# EAGLE design IOIO Homemade (EAGLE 5.11)
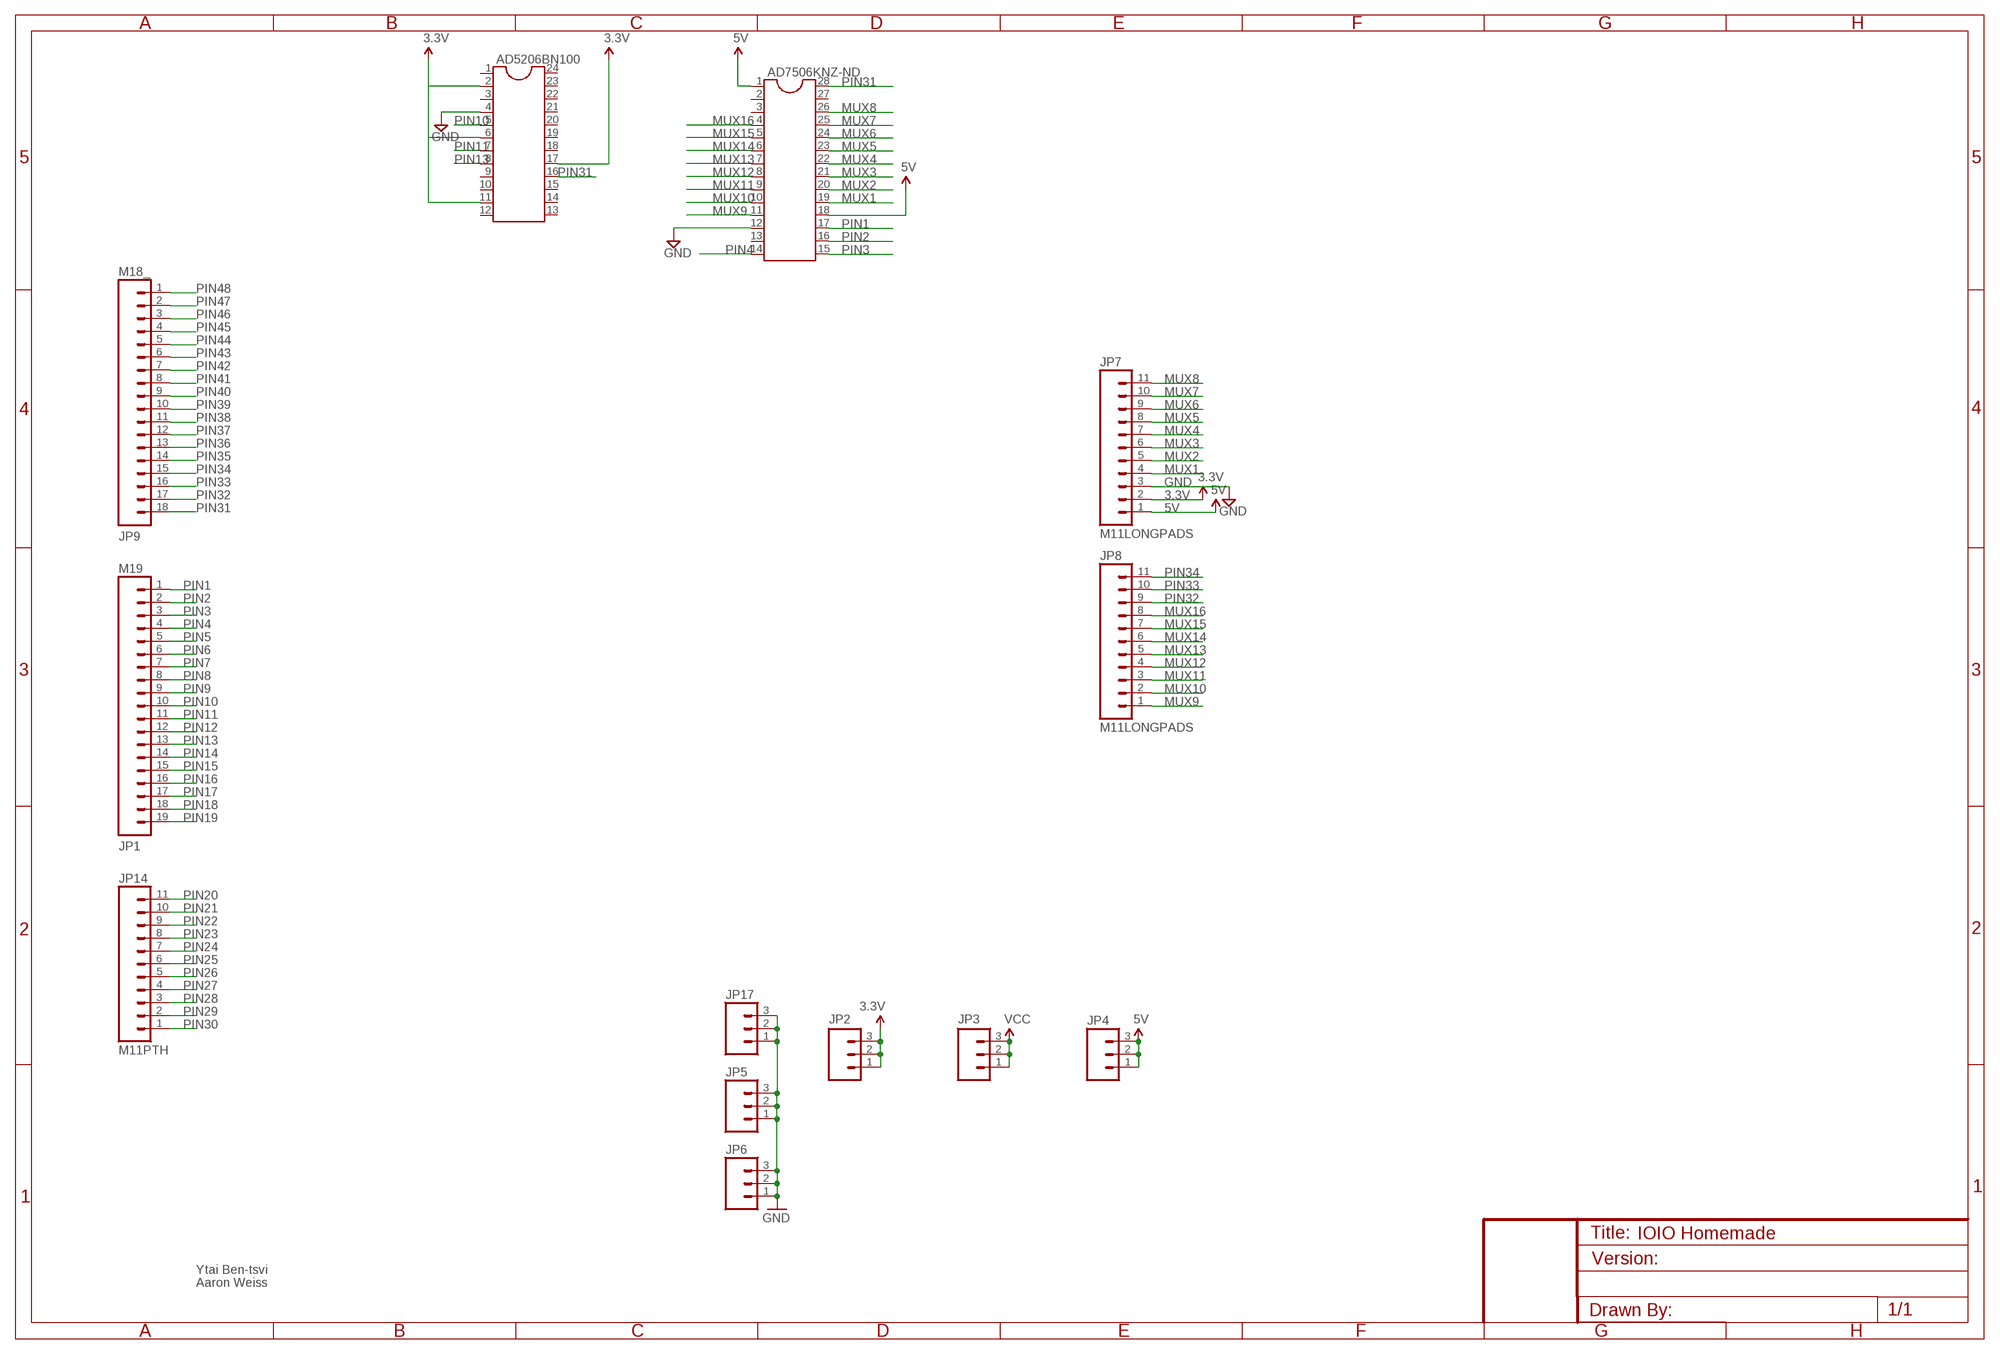
[diagram p0: schematic, sheet 1]

## Parts
AD5206BN100  DIL24-3  [DIL24-3]
AD7506KNZ-ND  DIL28  [DIL28-6]
JP1  M19  [1X19]
JP2  M03PTH  [1X03]
JP3  M03PTH  [1X03]
JP4  M03PTH  [1X03]
JP5  M03PTH  [1X03]
JP6  M03PTH  [1X03]
JP7  M11LONGPADS  [1X11_LONGPADS]
JP8  M11LONGPADS  [1X11_LONGPADS]
JP9  M18_  [1X18]
JP14  M11PTH  [1X11]
JP17  M03PTH  [1X03]

## Nets
3.3V: AD5206BN100.2 AD5206BN100.6 AD5206BN100.11 AD5206BN100.17 JP2.1 JP2.2 JP2.3 JP7.2
5V: AD7506KNZ-ND.1 AD7506KNZ-ND.18 JP4.1 JP4.2 JP4.3 JP7.1
GND: AD5206BN100.4 AD7506KNZ-ND.12 JP5.1 JP5.2 JP5.3 JP6.1 JP6.2 JP6.3 JP7.3 JP17.1 JP17.2 JP17.3
MUX1: AD7506KNZ-ND.19 JP7.4
MUX2: AD7506KNZ-ND.20 JP7.5
MUX3: AD7506KNZ-ND.21 JP7.6
MUX4: AD7506KNZ-ND.22 JP7.7
MUX5: AD7506KNZ-ND.23 JP7.8
MUX6: AD7506KNZ-ND.24 JP7.9
MUX7: AD7506KNZ-ND.25 JP7.10
MUX8: AD7506KNZ-ND.26 JP7.11
MUX9: AD7506KNZ-ND.11 JP8.1
MUX10: AD7506KNZ-ND.10 JP8.2
MUX11: AD7506KNZ-ND.9 JP8.3
MUX12: AD7506KNZ-ND.8 JP8.4
MUX13: AD7506KNZ-ND.7 JP8.5
MUX14: AD7506KNZ-ND.6 JP8.6
MUX15: AD7506KNZ-ND.5 JP8.7
MUX16: AD7506KNZ-ND.4 JP8.8
PIN1: AD7506KNZ-ND.17 JP1.1
PIN2: AD7506KNZ-ND.16 JP1.2
PIN3: AD7506KNZ-ND.15 JP1.3
PIN4: AD7506KNZ-ND.14 JP1.4
PIN5: JP1.5
PIN6: JP1.6
PIN7: JP1.7
PIN8: JP1.8
PIN9: JP1.9
PIN10: AD5206BN100.5 JP1.10
PIN11: AD5206BN100.7 JP1.11
PIN12: JP1.12
PIN13: AD5206BN100.8 JP1.13
PIN14: JP1.14
PIN15: JP1.15
PIN16: JP1.16
PIN17: JP1.17
PIN18: JP1.18
PIN19: JP1.19
PIN20: JP14.11
PIN21: JP14.10
PIN22: JP14.9
PIN23: JP14.8
PIN24: JP14.7
PIN25: JP14.6
PIN26: JP14.5
PIN27: JP14.4
PIN28: JP14.3
PIN29: JP14.2
PIN30: JP14.1
PIN31: AD5206BN100.16 AD7506KNZ-ND.28 JP9.18
PIN32: JP8.9 JP9.17
PIN33: JP8.10 JP9.16
PIN34: JP8.11 JP9.15
PIN35: JP9.14
PIN36: JP9.13
PIN37: JP9.12
PIN38: JP9.11
PIN39: JP9.10
PIN40: JP9.9
PIN41: JP9.8
PIN42: JP9.7
PIN43: JP9.6
PIN44: JP9.5
PIN45: JP9.4
PIN46: JP9.3
PIN47: JP9.2
PIN48: JP9.1
VCC: JP3.1 JP3.2 JP3.3
Unconnected: AD5206BN100.1 AD5206BN100.3 AD5206BN100.9 AD5206BN100.10 AD5206BN100.12 AD5206BN100.13 AD5206BN100.14 AD5206BN100.15 AD5206BN100.18 AD5206BN100.19 AD5206BN100.20 AD5206BN100.21 AD5206BN100.22 AD5206BN100.23 AD5206BN100.24 AD7506KNZ-ND.2 AD7506KNZ-ND.3 AD7506KNZ-ND.13 AD7506KNZ-ND.27

## Notes on the sheet
- Ytai Ben-tsvi
- Aaron Weiss

## Library data of the parts
AD5206BN100 = ic-package:DIL24: Dual In Line
AD7506KNZ-ND = ic-package:DIL28: Dual In Line
JP1 = SparkFun:M19
JP2-JP6 JP17 = SparkFun:M03: Header 3 Standard 3-pin 0.1" header. Use with straight break away headers (SKU : PRT-00116), right angle break away headers (PRT-00553), swiss pins (PRT-00743), machine pins (PRT-00117), and female headers (PRT-00115). Molex polarized connector foot print use with SKU : PRT-08232 with associated crimp pins and housings.
JP7 JP8 JP14 = SparkFun:M11: Header 11 Standard 11-pin 0.1" header. Use with straight break away headers (SKU : PRT-00116), right angle break away headers (PRT-00553), swiss pins (PRT-00743), machine pins (PRT-00117), and female headers (PRT-00115).
JP9 = SparkFun:M18

## Board
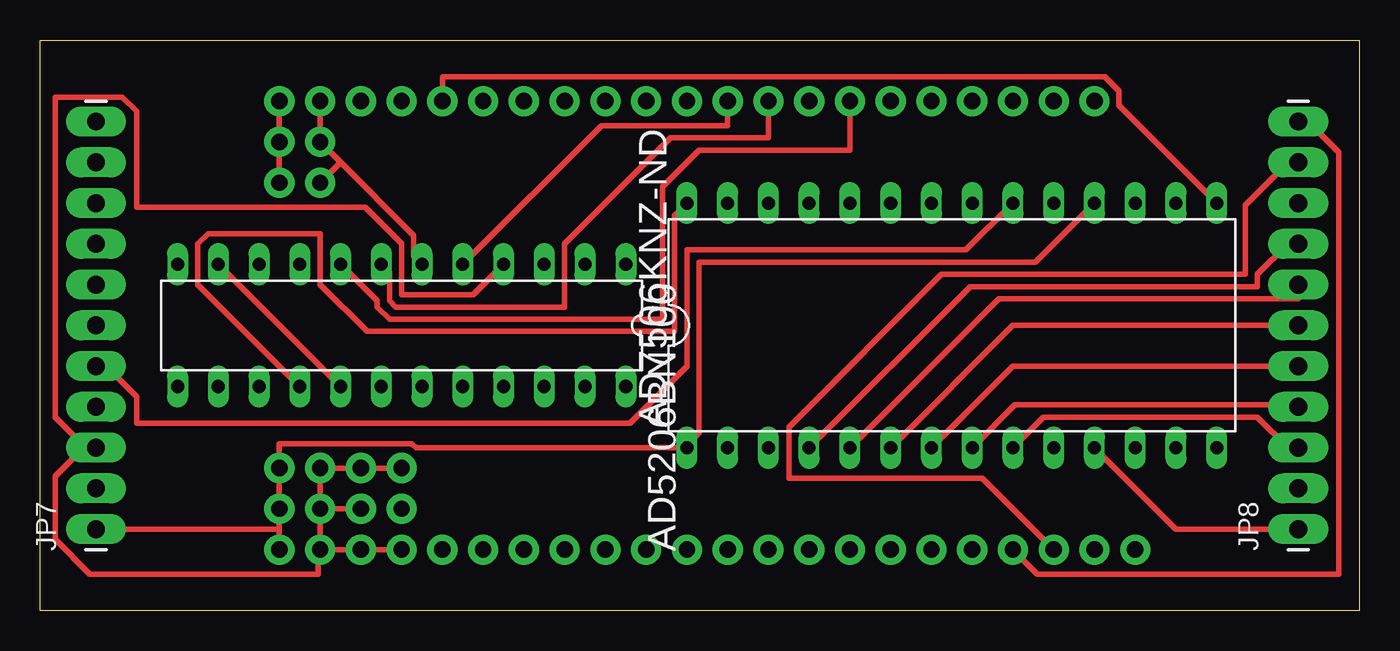
[diagram p1: board, top side]
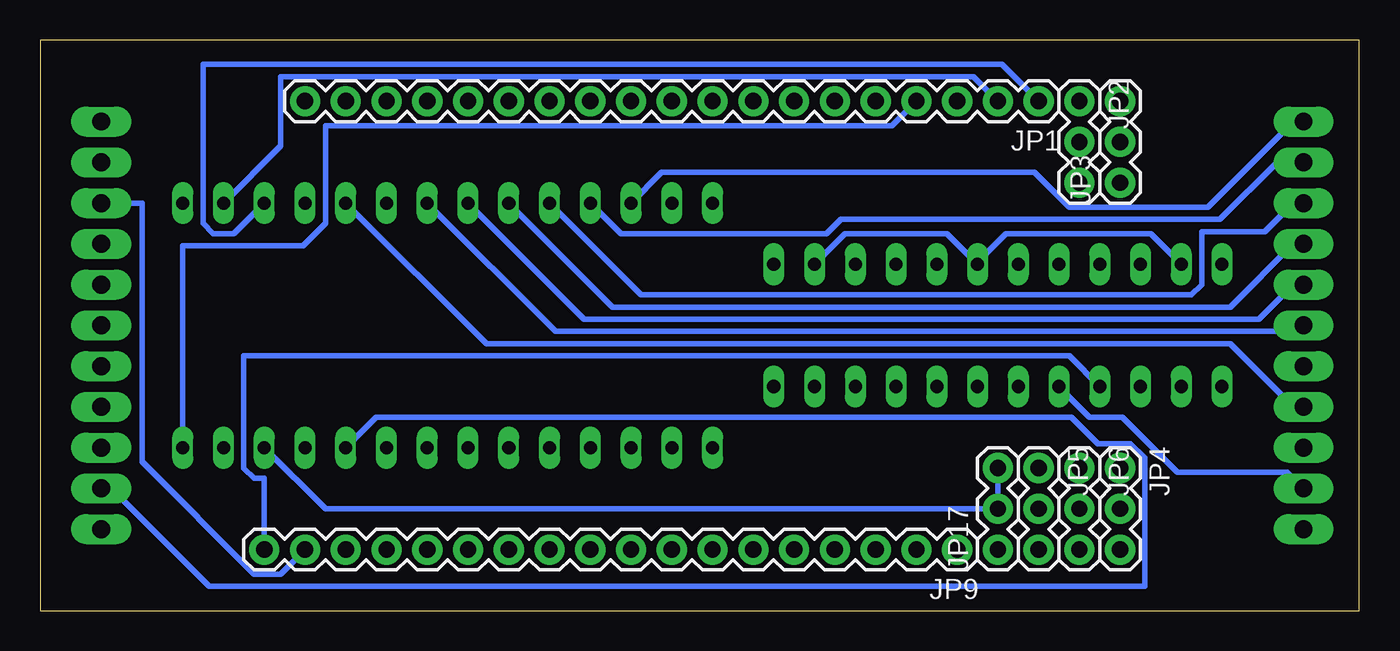
[diagram p2: board, bottom side, seen from below]

Size 82.22 x 35.55 mm. Coordinates in mm from the lower left corner, seen from the top.
Outline: 82.22,0 0,0 0,35.55 82.22,35.55 82.22,0
Copper layers (1*16): Top 0.035mm / dielectric 1.5mm / Bottom 0.035mm
Design rules "default *": minimum track width 14mil, minimum drill 24mil, track to track 16mil, track to pad 16mil, pad to pad 16mil, via to via 16mil, smd to smd 8mil, copper to edge 40mil, drill to drill 8mil, minimum pad ring 10mil, minimum via ring 8mil, stop-mask expansion 4mil, vias tented up to drill 0mil, thermal gap 10mil

### Footprints (pad centres in the part's own frame; a part is rotated, then mirrored left to right if it is on the bottom)
DIL24-3 = drill 0.813 long: 1 -13.97,-3.81; 2 -11.43,-3.81; 3 -8.89,-3.81; 4 -6.35,-3.81; 5 -3.81,-3.81; 6 -1.27,-3.81; 7 1.27,-3.81; 8 3.81,-3.81; 9 6.35,-3.81; 10 8.89,-3.81; 11 11.43,-3.81; 12 13.97,-3.81; 13 13.97,3.81; 14 11.43,3.81; 15 8.89,3.81; 16 6.35,3.81; 17 3.81,3.81; 18 1.27,3.81; 19 -1.27,3.81; 20 -3.81,3.81; 21 -6.35,3.81; 22 -8.89,3.81; 23 -11.43,3.81; 24 -13.97,3.81
DIL28-6 = drill 0.813 long: 1 -16.51,-7.62; 2 -13.97,-7.62; 3 -11.43,-7.62; 4 -8.89,-7.62; 5 -6.35,-7.62; 6 -3.81,-7.62; 7 -1.27,-7.62; 8 1.27,-7.62; 9 3.81,-7.62; 10 6.35,-7.62; 11 8.89,-7.62; 12 11.43,-7.62; 13 13.97,-7.62; 14 16.51,-7.62; 15 16.51,7.62; 16 13.97,7.62; 17 11.43,7.62; 18 8.89,7.62; 19 6.35,7.62; 20 3.81,7.62; 21 1.27,7.62; 22 -1.27,7.62; 23 -3.81,7.62; 24 -6.35,7.62; 25 -8.89,7.62; 26 -11.43,7.62; 27 -13.97,7.62; 28 -16.51,7.62
1X19 = drill 1.016 pad 1.88 round: 1 0,0; 2 2.54,0; 3 5.08,0; 4 7.62,0; 5 10.16,0; 6 12.7,0; 7 15.24,0; 8 17.78,0; 9 20.32,0; 10 22.86,0; 11 25.4,0; 12 27.94,0; 13 30.48,0; 14 33.02,0; 15 35.56,0; 16 38.1,0; 17 40.64,0; 18 43.18,0; 19 45.72,0
1X03 = drill 1.016 pad 1.88 round: 1 0,0; 2 2.54,0; 3 5.08,0
1X11_LONGPADS = drill 1.118 pad 1.88 long: 1 0,0; 2 2.54,0; 3 5.08,0; 4 7.62,0; 5 10.16,0; 6 12.7,0; 7 15.24,0; 8 17.78,0; 9 20.32,0; 10 22.86,0; 11 25.4,0
1X18 = drill 1.016 pad 1.88 round: 1 0,0; 2 2.54,0; 3 5.08,0; 4 7.62,0; 5 10.16,0; 6 12.7,0; 7 15.24,0; 8 17.78,0; 9 20.32,0; 10 22.86,0; 11 25.4,0; 12 27.94,0; 13 30.48,0; 14 33.02,0; 15 35.56,0; 16 38.1,0; 17 40.64,0; 18 43.18,0
1X11 = drill 1.016 pad 1.88 round: 1 0,0; 2 2.54,0; 3 5.08,0; 4 7.62,0; 5 10.16,0; 6 12.7,0; 7 15.24,0; 8 17.78,0; 9 20.32,0; 10 22.86,0; 11 25.4,0

### Placement (x,y rotation side)
AD5206BN100  22.53,17.78 180 top
AD7506KNZ-ND  56.82,17.78 0 top
JP1  19.99,31.75 180 bottom
JP2  17.45,31.75 270 bottom
JP3  14.91,26.67 90 bottom
JP4  14.91,8.89 270 bottom
JP5  19.99,8.89 270 bottom
JP6  17.45,8.89 270 bottom
JP7  3.48,5.08 90 top
JP8  78.41,5.08 90 top
JP9  25.07,3.81 180 bottom
JP14  96.19,6.35 90 bottom  (outside the outline)
JP17  22.53,3.81 90 bottom

### Tracks (layer width: path | path; a pad name or v marks a point on that pad's centre or on a via)
3.3V
  Top 0.356: AD5206BN100.6 23.29,22.1 23.29,23.37 18.66,28 | 18.66,28 JP2.2 JP2.1 | JP2.3 18.59,27.81 18.59,27.94 18.66,28 | AD5206BN100.17 AD5206BN100.11
  Bottom 0.356: AD5206BN100.2 32.05,23.5 25.71,23.5 AD5206BN100.6 23.8,21.72 22.02,23.5 13.01,23.5 AD5206BN100.11 | JP7.2 4.5,8.64 11.35,8.64 14.78,12.06 16.82,12.06 AD5206BN100.17
5V
  Top 0.356: 14.91,5.08 JP4.2 JP4.1 14.91,10.41 23.17,10.41 23.42,10.16 AD7506KNZ-ND.1 40.31,10.29 41.07,11.05 41.07,21.72 62.03,21.72 AD7506KNZ-ND.18 | 14.91,5.08 JP4.3 | JP7.1 14.91,5.08
GND
  Top 0.356: AD5206BN100.4 26.98,19.68 22.53,19.68 22.53,22.86 20.24,25.15 6.02,25.15 6.02,31.11 5.13,32 0.94,32 0.94,12.06 2.84,10.16 JP7.3 2.72,10.16 0.94,8.38 0.94,4.45 3.1,2.29 17.32,2.29 17.32,3.81 JP6.3 | JP6.3 JP6.2 | JP6.3 JP5.3 JP17.1 | JP6.2 JP5.2 | JP6.2 JP6.1 JP5.1 JP17.3
  Bottom 0.356: AD7506KNZ-ND.12 64.44,6.35 JP17.2 JP17.3
MUX1
  Bottom 0.356: AD7506KNZ-ND.19 54.41,16.64 8.05,16.64 4.12,12.7 JP7.4
MUX2
  Top 0.356: AD7506KNZ-ND.20 57.71,22.48 40.31,22.48 40.31,15.24 36.75,11.68 6.02,11.68 6.02,13.34 4.12,15.24 JP7.5
MUX3
  Bottom 0.356: AD7506KNZ-ND.21 50.09,17.4 3.86,17.4 JP7.6
MUX4
  Bottom 0.356: AD7506KNZ-ND.22 48.31,18.16 6.27,18.16 4.12,20.32 JP7.7
MUX5
  Bottom 0.356: AD7506KNZ-ND.23 46.53,18.92 8.05,18.92 4.12,22.86 JP7.8
MUX6
  Bottom 0.356: AD7506KNZ-ND.24 44.76,19.68 10.46,19.68 9.83,20.32 9.83,23.62 5.89,23.62 4.12,25.4 JP7.9
MUX7
  Bottom 0.356: AD7506KNZ-ND.25 46.02,23.5 33.2,23.5 32.31,24.38 8.69,24.38 5.13,27.94 JP7.10
MUX8
  Bottom 0.356: AD7506KNZ-ND.26 43.48,27.3 20.24,27.3 18.09,25.15 9.45,25.15 4.12,30.48 JP7.11
MUX9
  Top 0.356: AD7506KNZ-ND.11 70.79,5.08 JP8.1
MUX10
  Bottom 0.356: AD7506KNZ-ND.10 61.27,12.06 17.96,12.06 16.31,10.41 14.28,10.41 13.39,9.53 13.39,1.52 71.68,1.52 77.78,7.62 JP8.2
MUX11
  Top 0.356: AD7506KNZ-ND.9 62.54,12.06 75.87,12.06 77.78,10.16 JP8.3
MUX12
  Top 0.356: AD7506KNZ-ND.8 60.76,12.83 78.41,12.83 JP8.4
MUX13
  Top 0.356: AD7506KNZ-ND.7 60.63,15.24 JP8.5
MUX14
  Top 0.356: AD7506KNZ-ND.6 60.63,17.78 JP8.6
MUX15
  Top 0.356: AD7506KNZ-ND.5 59.74,19.43 78.41,19.43 JP8.7
MUX16
  Top 0.356: AD7506KNZ-ND.4 57.96,20.19 75.87,20.19 75.87,20.95 77.78,22.86 JP8.8
PIN1
  Bottom 0.356: AD7506KNZ-ND.17 70.16,23.5 71.42,23.5 72.06,24.13 72.06,34.04 22.28,34.04 JP1.1
PIN2
  Bottom 0.356: AD7506KNZ-ND.16 67.23,28.96 67.23,33.27 24.05,33.27 JP1.2
PIN3
  Top 0.356: AD7506KNZ-ND.15 67.23,31.5 67.23,32.38 66.34,33.27 25.07,33.27 JP1.3
PIN4
  Bottom 0.356: AD7506KNZ-ND.14 73.33,22.73 65.84,22.73 64.44,24.13 64.44,30.23 29.13,30.23 JP1.4
PIN10
  Top 0.356: AD5206BN100.5 34.98,30.23 42.85,30.23 JP1.10
PIN11
  Top 0.356: AD5206BN100.7 21.77,21.08 21.77,19.3 22.15,18.92 32.69,18.92 32.69,22.86 39.29,29.46 45.39,29.46 JP1.11
PIN13
  Top 0.356: AD5206BN100.8 21.01,19.3 21.01,18.92 21.77,18.16 38.79,18.16 38.79,26.42 41.07,28.7 50.47,28.7 JP1.13
PIN31
  Top 0.356: AD5206BN100.16 9.83,20.32 9.83,22.86 10.46,23.5 17.45,23.5 17.45,20.32 20.37,17.4 39.55,17.4 39.55,24.64 AD7506KNZ-ND.28
  Bottom 0.356: JP9.18 68.25,8.26 68.89,8.26 69.52,8.89 69.52,15.88 18.09,15.88 AD5206BN100.16
PIN32
  Bottom 0.356: JP9.17 67.23,2.29 68.89,2.29 75.87,9.27 75.87,25.4 JP8.9
PIN33
  Top 0.356: JP9.16 58.73,8.26 46.66,8.26 46.66,11.43 56.19,20.95 75.11,20.95 75.11,25.27 77.78,27.94 JP8.10
PIN34
  Top 0.356: JP9.15 62.15,2.29 80.95,2.29 80.95,28.57 79.05,30.48 JP8.11
VCC
  Top 0.356: JP3.1 JP3.2 JP3.3